# EAGLE design eagle-revg (EAGLE 9.6.2)
COMPANY: ADAFRUIT INDUSTRIES; DRAWN: KTOWN; REV: B
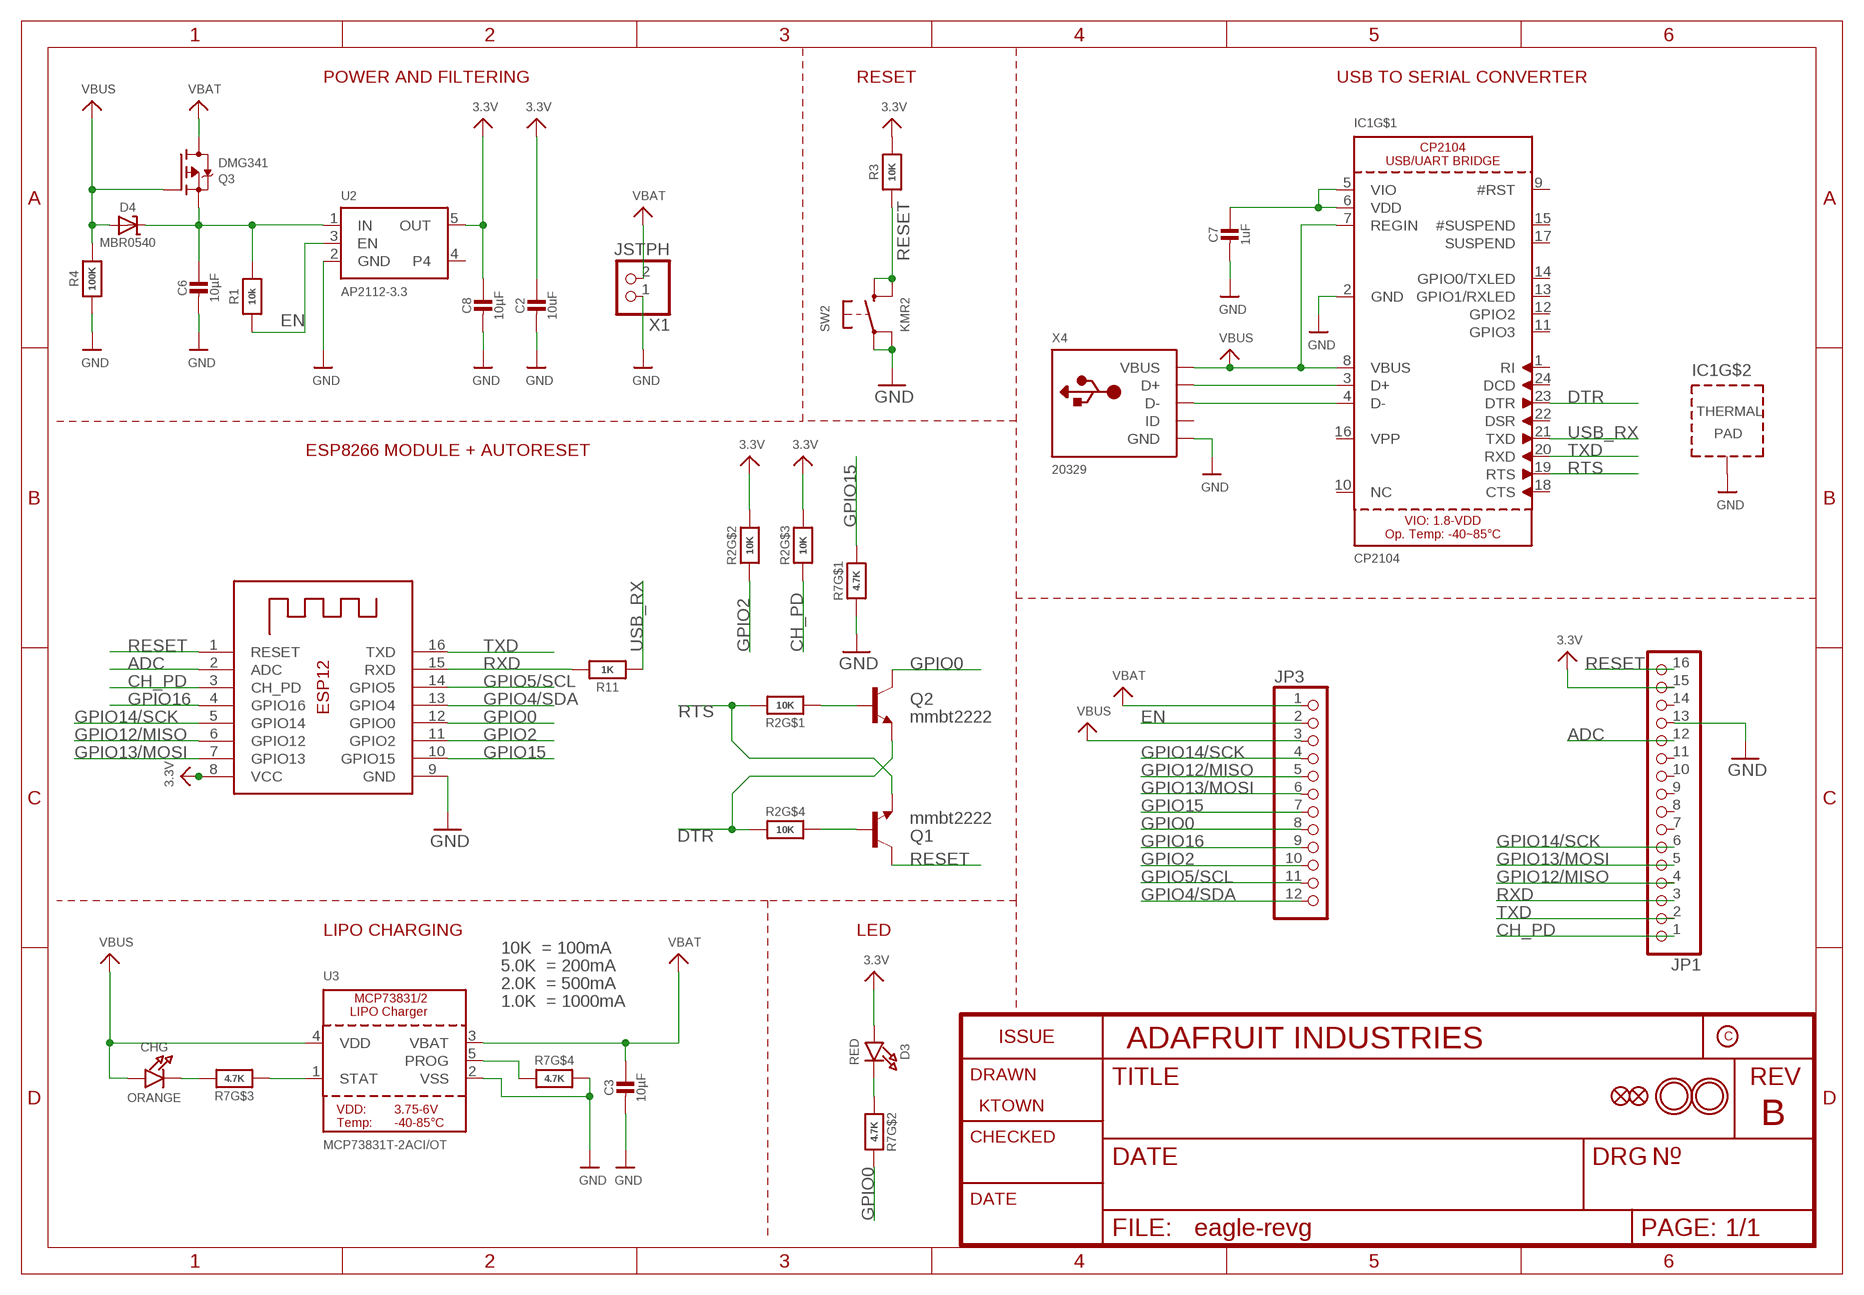
[diagram p0: schematic, sheet 1]

## Parts
C2  10uF  CAP_CERAMIC0805_10MGAP  [0805_10MGAP]
C3  10µF  CAP_CERAMIC0805-NOOUTLINE  [0805-NO]
C6  10µF  CAP_CERAMIC0805-NOOUTLINE  [0805-NO]
C7  1uF  CAP_CERAMIC0603_NO  [0603-NO]
C8  10µF  CAP_CERAMIC0805-NOOUTLINE  [0805-NO]
CHG  ORANGE  LED0603_NOOUTLINE  [CHIPLED_0603_NOOUTLINE]
D3  RED  LED0603_NOOUTLINE  [CHIPLED_0603_NOOUTLINE]
D4  MBR0540  DIODE-SCHOTTKYSOD-123  [SOD-123]
IC1  CP2104  [QFN24_4MM_SMSC]
JP1  HEADER-1X16ROUND  [1X16_ROUND]
JP3  HEADER-1X12  [1X12_ROUND]
Q1  mmbt2222  TRANSISTOR_NPNSOT23-3  [SOT23-3]
Q2  mmbt2222  TRANSISTOR_NPNSOT23-3  [SOT23-3]
Q3  DMG341  MOSFET-P  [SOT23-R]
R1  10k  RESISTOR_0603_NOOUT  [0603-NO]
R2  10K  RESISTOR_4PACK_NO  [RESPACK_4X0603_NO]
R3  10K  RESISTOR_0603_NOOUT  [0603-NO]
R4  100K  RESISTOR_0603_NOOUT  [0603-NO]
R7  4.7K  RESISTOR_4PACK_NO  [RESPACK_4X0603_NO]
R11  1K  RESISTOR_0603_NOOUT  [0603-NO]
SW2  KMR2  SWITCH_TACT_SMT4.6X2.8  [BTN_KMR2_4.6X2.8]
U2  AP2112-3.3  VREG_SOT23-5  [SOT23-5]
U3  MCP73831T-2ACI/OT  MCP73831/2  [SOT23-5]
U$31  MOUNTINGHOLE2.5  [MOUNTINGHOLE_2.5_PLATED]
U$32  MOUNTINGHOLE2.5  [MOUNTINGHOLE_2.5_PLATED]
U$34  FIDUCIAL_1MM  [FIDUCIAL_1MM]
U$35  FIDUCIAL_1MM  [FIDUCIAL_1MM]
X1  JSTPH  CON_JST_PH_2PIN_BATT  [JSTPH2_BATT]
X3  ESP-12F  ESP-12_DOIT_ESP8266  [ESP-12F]
X4  20329  USB_MICRO_20329_V2  [4UCONN_20329_V2]

## Nets
3.3V [power]: C2.1 C8.1 D3.A JP1.15 R2.6 R2.7 R3.2 U2.5(OUT) X3.8(VCC)
ADC: JP1.12 X3.2(ADC)
CH_PD: JP1.1 R2.3 X3.3(CH_PD)
DTR: IC1.23(DTR) Q2.2(E) R2.4
EN: JP3.2 R1.1 U2.3(EN)
GND: C2.2 C3.2 C6.2 C7.2 C8.2 IC1.2(GND) IC1.THERM(TP) JP1.13 R4.1 R7.1 R7.5 SW2.A'(P1) SW2.A(P) U2.2(GND) U3.2(VSS) X1.1 X3.9(GND) X4.BASE@1(GND) X4.BASE@2(GND) X4.GND X4.SPRT@1(GND) X4.SPRT@2(GND) X4.SPRT@3(GND) X4.SPRT@4(GND)
GPIO0: JP3.8 Q2.3(C) R7.7 X3.12(GPIO0)
GPIO2: JP3.10 R2.2 X3.11(GPIO2)
GPIO4/SDA: JP3.12 X3.13(GPIO4)
GPIO5/SCL: JP3.11 X3.14(GPIO5)
GPIO12/MISO: JP1.4 JP3.5 X3.6(GPIO12)
GPIO13/MOSI: JP1.5 JP3.6 X3.7(GPIO13)
GPIO14/SCK: JP1.6 JP3.4 X3.5(GPIO14)
GPIO15: JP3.7 R7.8 X3.10(GPIO15)
GPIO16: JP3.9 X3.4(GPIO16)
N$1: CHG.C R7.6
N$2: IC1.3(D+) X4.D+
N$3: R7.3 U3.1(STAT)
N$4: R7.4 U3.5(PROG)
N$5: D3.C R7.2
N$6: IC1.4(D-) X4.D-
N$8: C7.1 IC1.5(VIO) IC1.6(VDD)
N$12: Q1.1(B) R2.5
N$13: Q2.1(B) R2.1
RESET: JP1.16 Q1.3(C) R3.1 SW2.B'(S1) SW2.B(S) X3.1(RESET)
RTS: IC1.19(RTS) Q1.2(E) R2.8
RXD: JP1.3 R11.2 X3.15(RXD)
TXD: IC1.20(RXD) JP1.2 X3.16(TXD)
USB_RX: IC1.21(TXD) R11.1
VBAT [power]: C3.1 JP3.1 Q3.3(D) U3.3(VBAT) X1.2
VBUS [power]: CHG.A D4.A IC1.7(REGIN) IC1.8(VBUS) JP3.3 Q3.1(G) R4.2 U3.4(VDD) X4.VBUS
VHI [power]: C6.1 D4.C Q3.2(S) R1.2 U2.1(IN)
Unconnected: IC1.1(RI) IC1.9(#RST) IC1.10(NC) IC1.11(GPIO3) IC1.12(GPIO2) IC1.13(GPIO1/RXLED) IC1.14(GPIO0/TXLED) IC1.15(#SUSPEND) IC1.16(VPP) IC1.17(SUSPEND) IC1.18(CTS) IC1.22(DSR) IC1.24(DCD) JP1.7 JP1.8 JP1.9 JP1.10 JP1.11 JP1.14 U2.4 X4.ID

## Notes on the sheet
- POWER AND FILTERING | RESET | USB TO SERIAL CONVERTER
- ESP8266 MODULE + AUTORESET
- LIPO CHARGING | LED
- 10K  = 100mA
- 5.0K  = 200mA
- 2.0K  = 500mA
- 1.0K  = 1000mA

## Library data of the parts
C2 C3 C6 C7 = microbuilder:CAP_CERAMIC: Ceramic Capacitors For new designs, use the packages preceded by an '_' character since they are more reliable: The following footprints should be used on most boards: _0402 - Standard footprint for regular board layouts _0603 - Standard footprint for regular board layouts _0805 - Standard footprint for regular board layouts _1206 - Standard footprint for regular board layouts For extremely tight-pitch boards where space is at a premium, the following 'micro-pitch' footprints can be used (smaller pads, no silkscreen outline, etc.): _0402MP - Micro-pitch footprint for very dense/compact boards _0603MP - Micro-pitch footprint for very dense/compact boards _0805MP - Micro-pitch footprint for very dense/compact boards _1206MP - Micro-pitch footprint for very dense/compact boards
C8 = microbuilder:CAP_CERAMIC: Ceramic Capacitors For new designs, use the packages preceded by an '_' character since they are more reliable: The following footprints should be used on most boards: _0402 - Standard footprint for regular board layouts _0603 - Standard footprint for regular board layouts _0805 - Standard footprint for regular board layouts _1206 - Standard footprint for regular board layouts For extremely tight-pitch boards where space is at a premium, the following 'micro-pitch' footprints can be used (smaller pads, no silkscreen outline, etc.): _0402MP - Micro-pitch footprint for very dense/compact boards _0603MP - Micro-pitch footprint for very dense/compact boards _0805MP - Micro-pitch footprint for very dense/compact boards _1206MP - Micro-pitch footprint for very dense/compact boards; REV: G
CHG D3 = microbuilder:LED: LED 0603 - 0603 Surface Mount Package 2mA: Green LED - Low Power (3.9mcd, 2ma, 1.7Vf) - Digikey: 475-2709-2-ND Orange LED - Low Power (9.8mcd, 2ma, 1.8Vf) - Digikey: 475-1194-2-ND Red LED - Low Power (5mcd, 2ma, 1.8Vf) - Digikey: 475-1195-2-ND Yellow LED - Low Power (7mcd, 2ma, 1.8Vf) - Digikey: 475-1196-2-ND 5mA: Blue LED - Low Power (17mcd, 5ma, 2.9Vf) - Digikey: LNJ937W8CRACT-ND 0805 - 0805 Surface Mount Package 2mA: Red LED (8.8mcd, 2mA, 1.8Vf, Clear) - Low Power [Digikey: 475-2510-1-ND] Green LED (5mcd, 2mA, 1.8Vf, Clear) - Low Power [Digikey: 475-2730-1-ND] Yellow LED (11.3mcd, 2mA, 1.8Vf, Clear) - Low Power [Digikey: 475-2555-1-ND] 20mA: Red LED (104mcd, 20mA, Diffused) - LS R976 [Digikey: 475-1278-6-ND] Red LED (12mcd, 20mA, 2.0Vf, Clear) - APT2012EC [Digikey: 754-1128-1-ND] Green LED (15mcd, 20mA, 2.2Vf, Clear) - APT2012GC [Digikey: 754-1131-1-ND] Orange LED (160mcd, 20mA, 2.1Vf, Clear) - APT2012SECK [Digikey: 754-1130-1-ND] 1206 - 1206 Surface Mount Package Green LED (26mcd, 20mA, Diffused) - LG N971 [Digikey: 475-1407-6-ND] Red LED (15mcd, 20mA, Diffused) - LH N974 [Digikey: 475-1416-6-ND] Cree - Cree High-Power Surface Mount LEDs XPEBWT-L1-0000-00D50 - White 111lm 350mA 2.9Vf 6200K 110° XTEAWT-00-0000-00000LEE3 - White 114lm 350mA 2.85Vf 5000K 115° Everlight - Everlight 45-21 Series Surface Mount LEDs 45-21/QK2C-B2832AC2CB2/2T - Warm White 2000mcd 20mA 3.25Vf 3050K 120° 45-21/LK2C-B38452C4CB2/2T - Nuetral White 2000mcd 20mA 3.25Vf 4150K 120° 45-21/LK2C-B50634C6CB2/2T - Cold White 2200mcd 20mA 3.25Vf 5650K 120° PLCC2 Reverse Mount LS T77K-J1L2-1-0-2-R18-Z - Red 11.25mcd 2mA 1.8Vf 630nm 120° LO T77K-L1M2-24-Z - Orange 19.6mcd 2mA 1.8Vf 606nm 120° LY T77K-K2M1-26-Z - Yellow 15.7mcd 2mA 1.8Vf 587nm 120°
D4 = microbuilder:DIODE-SCHOTTKY
IC1 = microbuilder:CP2104: CP2104 - USB to UART Bridge VDD Output: 3.45V
JP1 = microbuilder:HEADER-1X16: PIN HEADER
JP3 = microbuilder:HEADER-1X12
Q1 Q2 = SparkFun:TRANSISTOR_NPN: Transistor NPN BJT configuration in SOT23 package. MMBT2222 is the common NPN we use. Double check BCE configuration again layout.
Q3 = microbuilder:MOSFET-P: P-Channel Mosfet LEGEND VDS: Voltage Drain-Source ID: Drain Current RDS(ON): Drain-Source On-State Resistance VGS(TH): Gate-Source Threshold Voltage CISS: Drain-Source Input Capacitance SOT-23 Name VDS ID RDS(ON) VGS(TH) CISS Order Number IRLML5103 30V 760mA 600 mOhm -- 75pF @ 25V Digikey: IRLML5103PBFCT-ND IRLML6401 12V 4.3A 50 mOhm 950mV @ 250µA 830pF @ 10V Digikey: IRLML6401PBFTR-ND NTR0202PL 20V 400mA 800 mOhm 2.3V @ 250uA 70pF @ 5V Digikey: NTR0202PLT1GOSTR-ND NTR4101PT1G 20V 1.8A 85 mOhm 1.2V @ 250uA 675pF @ 10V Digikey: NTR4101PT1GOSCT-ND DMP2004K 20V 600mA 900 mOhm 1V @ 250uA 175pF @ 16V Digikey: DMP2004KDICT-ND PMV65XP 20V 3.9A 76 mOhm 950mV @ 1mA 725pF @ 20V Digikey: 568-2358-2-ND TO-252 Name VDS ID RDS(ON) VGS(TH) CISS Order Number AOD417 30V 25A 34 mOhm 3V @ 250µA 920pF @ 15V Digikey: 785-1106-2-ND PowerPak Name VDS ID RDS(ON) VGS(TH) CISS Order Number AON7401 30V 12A 14 mOhm 3V @ 250µA 2600pF @ 15V Digikey: 785-1302-1-ND
R1 R3 R4 R11 = microbuilder:RESISTOR: Resistors For new designs, use the packages preceded by an '_' character since they are more reliable: The following footprints should be used on most boards: _0402 - Standard footprint for regular board layouts _0603 - Standard footprint for regular board layouts _0805 - Standard footprint for regular board layouts _1206 - Standard footprint for regular board layouts For extremely tight-pitch boards where space is at a premium, the following 'micro-pitch' footprints can be used (smaller pads, no silkscreen outline, etc.): _0402MP - Micro-pitch footprint for very dense/compact boards _0603MP - Micro-pitch footprint for very dense/compact boards _0805MP - Micro-pitch footprint for very dense/compact boards _1206MP - Micro-pitch footprint for very dense/compact boards
R2 R7 = microbuilder:RESISTOR_4PACK: Resistor Packs (4 resistors) 4 x 0603 10K 1/16W - Digikey: YC164J-10KCT-ND
SW2 = microbuilder:SWITCH_TACT_SMT: SMT Tact Switches 6x6mm - Digikey: P12940SCT-ND KMR2 (4.6x2.8mm) - Digikey: 401-1426-1-ND EVQ-PQHB55 - Light Touch, 160GF (4.5x4.5mm) - Digikey: P8090SCT-ND KMT0 - KMT021 NGJ LHS (etc.) IP68/Waterproof - Digikey: CKN10289CT-ND
U2 = microbuilder:VREG_SOT23-5: SOT23-5 Fixed Voltage Regulators Part Current Out V Out V In V Dropout θJA (°C/W) TJ (°C) Digikey Part No. ADP121 150mA 3.3V 3.4-5.5V 0.09V @ 150mA -- -- ADP121-AUJZ33R7CT-ND ADP121 150mA 3.0V 3.1-5.5V 0.09V @ 150mA -- -- ADP121-AUJZ30R7CT-ND ADP122 300mA 3.3V 3.4-5.5V 0.085V @ 300mA -- -- ADP122AUJZ-3.3-R7CT-ND ADP1712 300mA 3.3V 3.5-5.5V 0.17V @ 300mA -- -- ADP1712AUJZ-3.3-R7TR-ND AP7311 (Low Cost) 150mA 3.3V 3.5-6V 0.15V @ 150mA -- -- AP7311-33WG-7DICT-ND LD39015M18R 150mA 1.8V 1.9V-5.5V 0.08V @ 100mA -- -- 497-6977-1-ND LP2985A-33DBVR 150mA 3.3V 3.3-16V 0.28V @ 150mA 206 150 296-18479-1-ND MCP1824T-3302E/OT 300mA 3.3V 3.5V-6V 0.2V @ 300mA -- -- MCP1824T-3302E/OTCT-ND MIC5205-2.5YM5 TR 150mA 2.5V 2.7-16V 0.165V @ 150mA -- -- 576-1257-2-ND MIC5205-3.0YM5 TR 150mA 3.0V 3.2V-16V 0.165V @ 150mA -- -- 576-1258-2-ND MIC5205-3.3YM5 TR 150mA 3.3V 3.5V-16V 0.165V @ 150mA -- -- 576-1259-2-ND TPS780330220 150mA 3.3V+2.2V 3.6-5.5V 250mV Max -- -- 296-23332-1-ND TDA3663/N1,135 100mA 3.3V 3.5-45V 0.18V @ 50mA -- -- 568-5343-1-ND Max operating temp can be calculated using θJA, TJ (max junction temperature), and power in watts. Set the "Maximum Ambient Temperature" until it reaches TJ ("Max Junction Temperature"), which is the absolute limit for safe use of the regulator: Heat Sink Temperature Calculator <http://www.daycounter.com/Calculators/Heat-Sink-Temperature-Calculator.phtml> For example, With 12V source into a 3.3V LP2985 and a 30mA load, we are dissipating (12V-3.3V) * 0.03A = 0.261W. With a θJA of 206 °C/W, a TJ of 150°C, and 261mW we can safely use the chip without a heat sink up to 75°C (=147.1°C Junction Temperature).
U3 = microbuilder:MCP73831/2: MCP73831/2 LIPO Charger VDD: 3.75 - 6V Temp -40 - 85°C Programmable Charge Rate: 15-500mA NOTE: STAT is a tri-state logic output on the MCP73831 and an open-drain output on the MCP73832. SOT23-5 with 4.2V output and tri-state logic on STAT = MCP73831T-2ACI/OT
U$31 U$32 = microbuilder:MOUNTINGHOLE: Mounting Hole For #2 screws (0.086"/2.18mm width, 0.094"/2.4mm hole) use 2.5mm; BOM: EXCLUDE
U$34 U$35 = microbuilder:FIDUCIAL: Fiducial Alignment Points Various fiducial points for machine vision alignment.; BOM: EXCLUDE
X1 = microbuilder:CON_JST_PH_2PIN: JST 2-Pin Right-Angle Connector PH-Series - 4UConnector: 17311 SH-Series - 4UConnector: 07278
X3 = microbuilder:ESP-12
X4 = microbuilder:USB: USB Connectors USBMINIB - Surface Mount Female Mini-B USB Connector 4UConnector: 06564

## Net classes
1 power: width 0.305 mm
2 gnd: width 0.254 mm

## Board
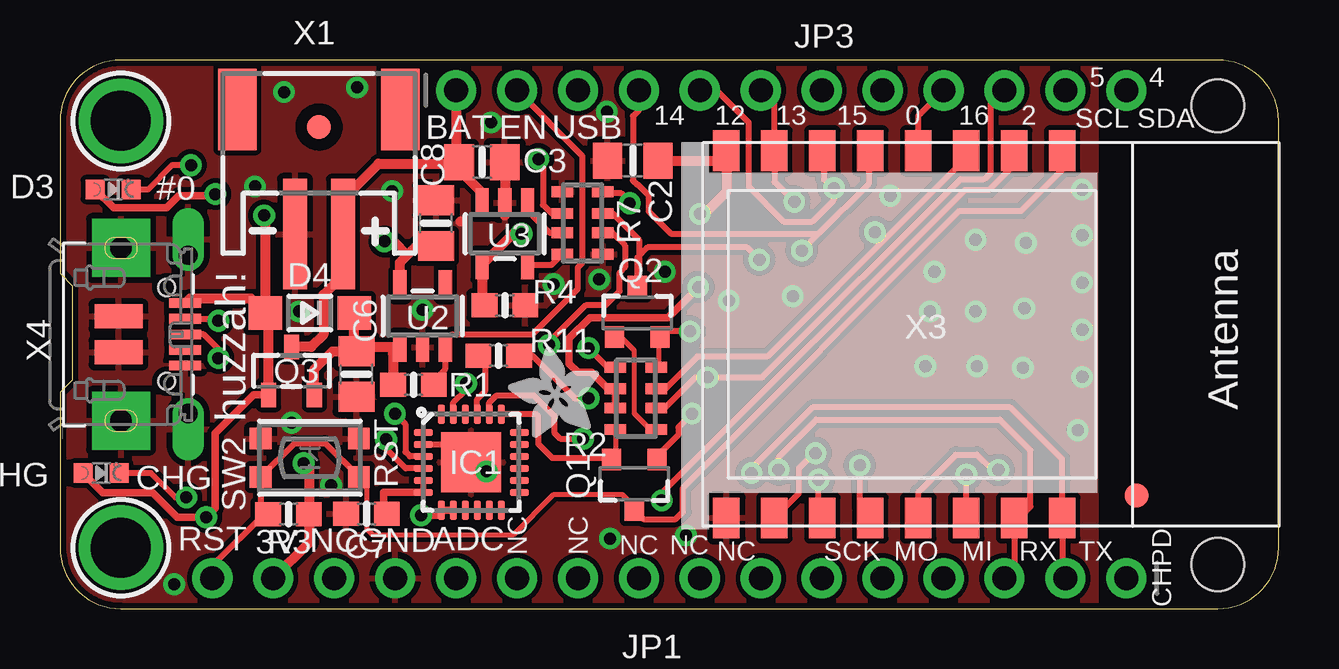
[diagram p1: board, top side]
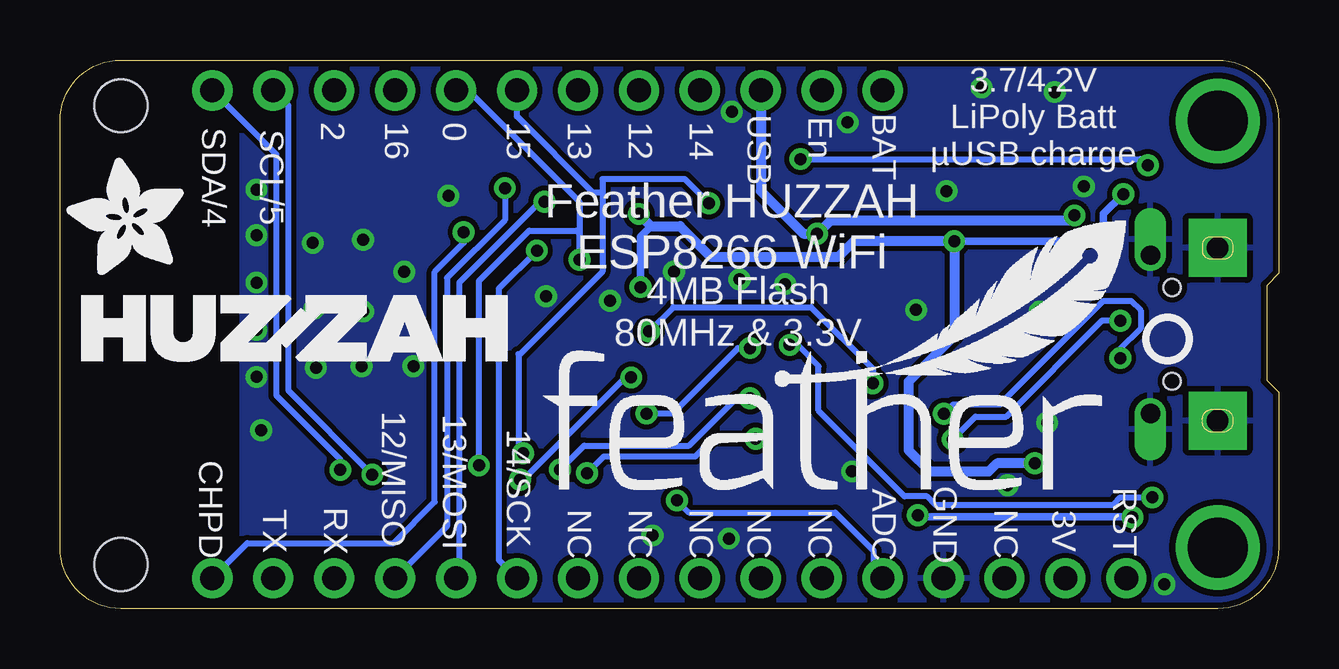
[diagram p2: board, bottom side, seen from below]

Size 50.8 x 22.86 mm. Coordinates in mm from the lower left corner, seen from the top.
Outline: 2.54,0 48.26,0 arc90 50.8,2.54 50.8,20.32 arc90 48.26,22.86 2.54,22.86 arc90 0,20.32 0,13.97 0.51,13.46 0.51,9.53 0,9.02 0,2.54 arc90 2.54,0
Copper layers (1*16): Top 0.035mm / dielectric 1.5mm / Bottom 0.035mm
Design rules "adafruit *": minimum track width 8mil, minimum drill 15.5mil, track to track 8mil, track to pad 8mil, pad to pad 8mil, via to via 8mil, smd to smd 8mil, copper to edge 10mil, drill to drill 8mil, minimum pad ring 10mil, minimum via ring 8mil, stop-mask expansion 2mil, vias tented up to drill 20mil, thermal gap 10mil
Holes 2.2 mm at 48.26,1.84 48.26,20.95

### Footprints (pad centres in the part's own frame; a part is rotated, then mirrored left to right if it is on the bottom)
0805_10MGAP = smd 1.2 x 1.5: 1 -1.05,0; 2 1.05,0
0805-NO = smd 1.24 x 1.5: 1 -0.95,0; 2 0.95,0
0603-NO = smd 1.075 x 1: 1 -0.85,0; 2 0.85,0
CHIPLED_0603_NOOUTLINE = smd 0.8 x 0.8: A 0,-0.75; C 0,0.75
SOD-123 = smd 1.4 x 1.4: A 1.85,0; C -1.85,0
QFN24_4MM_SMSC = smd 0.8 x 0.28: 1 -2,1.25; 2 -2,0.75; 3 -2,0.25; 4 -2,-0.25; 5 -2,-0.75; 6 -2,-1.25; 13 2,-1.25; 14 2,-0.75; 15 2,-0.25; 16 2,0.25; 17 2,0.75; 18 2,1.25 | smd 0.28 x 0.8: 7 -1.25,-2; 8 -0.75,-2; 9 -0.25,-2; 10 0.25,-2; 11 0.75,-2; 12 1.25,-2; 19 1.25,2; 20 0.75,2; 21 0.25,2; 22 -0.25,2; 23 -0.75,2; 24 -1.25,2 | smd 2.5 x 2.5: THERM 0,0
1X16_ROUND = drill 1 pad 1.676: 1 -19.05,0; 2 -16.51,0; 3 -13.97,0; 4 -11.43,0; 5 -8.89,0; 6 -6.35,0; 7 -3.81,0; 8 -1.27,0; 9 1.27,0; 10 3.81,0; 11 6.35,0; 12 8.89,0; 13 11.43,0; 14 13.97,0; 15 16.51,0; 16 19.05,0
1X12_ROUND = drill 1 pad 1.676: 1 -13.97,0; 2 -11.43,0; 3 -8.89,0; 4 -6.35,0; 5 -3.81,0; 6 -1.27,0; 7 1.27,0; 8 3.81,0; 9 6.35,0; 10 8.89,0; 11 11.43,0; 12 13.97,0
SOT23-3 = smd 0.8 x 0.9: 1 -0.95,-1; 2 0.95,-1; 3 0,1.1
SOT23-R = smd 0.635 x 1.016: 1 -0.95,-1; 2 0.95,-1; 3 0,1
RESPACK_4X0603_NO = smd 0.45 x 0.9: 1 -1.3,-0.85; 2 -0.4,-0.85; 3 0.4,-0.85; 4 1.3,-0.85; 5 1.3,0.85; 6 0.4,0.85; 7 -0.4,0.85; 8 -1.3,0.85
BTN_KMR2_4.6X2.8 = smd 0.9 x 0.9: A 2.05,0.8; A' -2.05,0.8; B 2.05,-0.8; B' -2.05,-0.8
SOT23-5 = smd 0.55 x 1.2: 1 -0.95,-1.3; 2 0,-1.3; 3 0.95,-1.3; 4 0.95,1.3; 5 -0.95,1.3
MOUNTINGHOLE_2.5_PLATED = drill 2.5 pad 3.2: P$1 0,0
FIDUCIAL_1MM = smd 1 x 1: 1 0,0
JSTPH2_BATT = smd 1 x 4.6: 1 -1,-3.7; 2 1,-3.7 | smd 1.6 x 3.4: NC1 -3.4,1.5; NC2 3.4,1.5
ESP-12F = smd 1.7 x 1.1: 1 -7.65,5.77; 2 -7.65,3.77; 3 -7.65,1.77; 4 -7.65,-0.23; 5 -7.65,-2.23; 6 -7.65,-4.23; 7 -7.65,-6.23; 8 -7.65,-8.23; 9 7.65,-8.23; 10 7.65,-6.23; 11 7.65,-4.23; 12 7.65,-2.23; 13 7.65,-0.23; 14 7.65,1.77; 15 7.65,3.77; 16 7.65,5.77
4UCONN_20329_V2 = smd 1 x 2: BASE@1 -0.75,-2; BASE@2 0.75,-2 | smd 0.4 x 1.35: D+ 0,0.775; D- -0.65,0.775; GND 1.3,0.775; ID 0.65,0.775; VBUS -1.3,0.775 | drill 0.8 pad 1.143 offset: SPRT@1 -3.3,0.9; SPRT@2 3.3,0.9 | drill 0.9 pad 2.413 square: SPRT@3 -3.6,-1.9; SPRT@4 3.6,-1.9 | hole 0.7: -1.95,0; 1.95,0

### Placement (x,y rotation side)
C2  23.88,18.67 180 top
C3  17.59,18.61 0 top
C6  12.36,9.77 270 top
C7  12.78,3.95 180 top
C8  15.67,16.06 90 top
CHG  1.71,5.65 270 top
D3  2.22,17.46 270 top
D4  10.41,12.32 180 top
IC1  17.14,6.1 0 top
JP1  25.4,1.27 180 top
JP3  30.48,21.59 0 top
Q1  23.94,5.21 180 top
Q2  24.07,12.32 0 top
Q3  9.65,9.91 0 top
R1  14.73,9.33 180 top
R2  24,8.76 90 top
R3  9.53,3.94 0 top
R4  18.54,12.64 180 top
R7  21.78,16.07 270 top
R11  18.29,10.54 0 top
SW2  10.41,6.29 0 top
U2  15.11,12.19 0 top
U3  18.54,15.62 180 top
U$7  [ADAFRUIT_5MM]  45.66,13.91 90 bottom
U$9  [FEATHERLOGO]  30.67,4.89 0 bottom
U$13  [PCBFEAT-REV-040]  4.64,11.24 0 bottom
U$15  [ADAFRUIT_3.5MM]  22.48,7.11 90 top
U$23  [HUZZAHLOGO]  49.91,10.29 0 bottom
U$31  2.54,20.32 270 top
U$32  2.54,2.54 270 top
U$34  10.79,20.07 270 top
U$35  44.88,4.71 270 top
X1  10.79,19.3 0 top
X3  36,11.43 270 top
X4  4.45,11.43 270 top

### Tracks (layer width: path | path; a pad name or v marks a point on that pad's centre or on a via)
3.3V  (via drill 0.5)
  Top 0.305: R2.7 R2.6 22.84,9.16 22.16,9.84 21.59,9.84 21.23,10.21 21.23,11.26 22.1,12.13 25.34,12.13 v26.61,13.4 | D3.A 2.23,16.7 4.45,16.7 4.95,17.21 6.41,17.21 v6.48,17.27
  Top 0.406: C8.1 14.86,15.11 14.48,14.73 | 14.48,14.73 14.16,14.41 U2.5 | JP1.15 10.38,2.75 R3.2 10.38,5.84 v10.16,6.05 | C2.1 27.36,18.67 X3.8 27.77,17.36 26.86,16.45 v26.67,16.45 | v13.53,15.3 13.91,15.3 14.48,14.73
  Bottom 0.305: v6.48,17.27 7.3,16.45 7.3,16 8,15.3 v13.53,15.3 | v26.61,13.4 26.61,15.49 26.16,15.94
  Bottom 0.406: v26.67,16.45 26.16,15.94 24.96,15.94 23.69,14.67 18.35,14.67 17.72,15.3 v13.53,15.3 13.53,11.37 15.43,9.46 15.43,6.6 14.54,5.71 12.09,5.71 11.75,6.05 v10.16,6.05
ADC  (via drill 0.5)
  Top 0.254: v25.08,4.51 25.08,4.8 37.72,17.44 38.73,17.44 39.77,18.49 X3.2
  Bottom 0.254: v25.08,4.51 24.57,4 18.48,4 16.89,2.41 16.89,1.97 16.57,1.65 16.57,1.33 JP1.12
CH_PD  (via drill 0.5)
  Top 0.254: R2.3 25.23,9.16 26.57,10.5 29.48,10.5 34.32,15.34 | X3.3 37.77,18.79 34.32,15.34 | v33.97,15.68 34.32,15.34
  Bottom 0.254: JP1.1 42.99,2.73 36.89,2.73 35.18,4.45 35.18,14.03 33.97,15.24 v33.97,15.68
DTR  (via drill 0.5)
  Top 0.203: 25.08,11.3 25.03,11.3 Q2.2 | 24.95,11.56 24.95,11.43 24.95,10.16 R2.4
  Top 0.254: v16.92,9.38 16.92,9.11 16.39,8.58 IC1.23 | v26.25,11.55 24.96,11.55 24.95,11.56 | 24.95,11.43 25.08,11.3
  Bottom 0.254: v16.92,9.38 16.92,10 19.49,12.57 25.23,12.57 v26.25,11.55
EN
  Top 0.254: R1.1 15.58,9.52 16.06,10 U2.3 16.06,11.15 16.35,11.43 19.69,11.43 21.59,13.33 21.59,14.22 21.78,14.41 21.78,18.86 JP3.2
GND  (via drill 0.5)
  Top 0.203: 17.4,6.1 v17.78,5.71 | IC1.THERM 17.4,6.1 | 17.4,6.1 18.03,6.73
  Top 0.254: IC1.2 17.03,6.85 17.14,6.73 IC1.THERM | 18.03,6.73 17.92,6.85
  Top 0.406: C3.2 U3.2 18.54,16.38 | 16.71,16.14 16.69,16.14 | 15.82,17.01 C8.2
  other vias: 17.97,20.26 27.88,12.83 30.54,13.02 36.26,12.38 38.16,12.38 38.23,10.1 36.07,10.1 42.42,7.43 40.26,15.24 38.16,15.37 36.45,14.03 40.13,10.03 40.2,12.51 42.61,9.65 42.61,11.62 42.61,13.59 42.61,15.56 42.61,17.46 26.1,3.05 22.92,2.92 34.61,17.21 13.84,17.4 15.11,12.45 20.57,13.53 9.33,21.53 12.38,21.72 8.13,17.59 22.8,20.7 22.48,13.72 9.65,7.75 4.76,1.02 25.21,14.03 11.3,5.14 9.97,12.38
  pour Top: 0,22.86 0,0 43.18,0 43.18,22.86
  pour Bottom: -0.13,0.25 43.18,0 43.18,22.86 0,22.86
GPIO0  (via drill 0.5)
  Top 0.254: R7.7 23.03,16.46 24.13,15.37 24.13,13.48 Q2.3 24.07,14.63 24.49,15.05 28.64,15.05 v29.15,14.54 | X3.12 33.34,4.22 v33.34,5.97
  Bottom 0.254: v33.34,5.97 33.34,13.65 31.24,15.75 29.27,15.75 29.15,15.62 v29.15,14.54 29.15,16.95 33.78,21.59 JP3.8
GPIO2  (via drill 0.5)
  Top 0.254: R2.2 25.21,8.36 26.48,9.63 v26.99,9.63 29.27,9.63 37.53,17.9 38.54,17.9 38.8,18.16 38.8,21.02 JP3.10 | X3.11 31.62,3.93 v31.62,5.37
  Bottom 0.254: v31.62,5.37 31.49,5.37 26.99,9.87 v26.99,9.63
GPIO4/SDA  (via drill 0.5)
  Top 0.254: X3.13 35.77,4.85 37.34,6.41 38.23,6.41 38.86,5.78 v39.12,5.78
  Bottom 0.254: v39.12,5.78 39.12,6.22 41.78,8.89 41.78,18.92 JP3.12
GPIO5/SCL  (via drill 0.5)
  Top 0.254: X3.14 v37.77,5.58 v37.78,5.59
  Bottom 0.254: v37.78,5.59 41.27,9.08 41.27,20.95 JP3.11
GPIO12/MISO  (via drill 0.5)
  Top 0.254: X3.6 31.84,19.02 31.84,17.88 32.19,17.53 v32.26,17.53 32.26,17.02 31.37,16.13 30.16,16.13 28.7,17.59 28.7,20.26 27.37,21.59 JP3.5
  Bottom 0.254: JP1.4 34.67,3.43 34.67,13.78 32.26,16.19 v32.26,17.53
GPIO13/MOSI  (via drill 0.5)
  Top 0.254: JP3.6 29.77,21.03 X3.7 29.77,17.79 v30.61,16.95
  Bottom 0.254: v30.61,16.95 30.8,16.95 34.16,13.59 34.16,1.4 JP1.5
GPIO14/SCK  (via drill 0.5)
  Top 0.254: X3.5 33.71,19.02 33.71,17.71 31.62,15.62 | 31.62,15.62 v30.92,14.92 | JP3.4 24.13,20.77 23.88,20.52 23.88,17.84 24.05,17.67 24.07,17.67 24.53,17.21 24.53,16.55 25.46,15.62 31.62,15.62
  Bottom 0.254: v30.92,14.92 32.51,13.34 32.51,2.03 JP1.6
GPIO15  (via drill 0.5)
  Top 0.254: R7.8 22.69,17.3 23.4,17.3 23.75,16.95 v23.75,16.89 | X3.10 30.79,4.8 30.79,5.83 31.43,6.48 v31.5,6.48
  Bottom 0.254: v23.75,16.89 24.77,17.91 28.19,17.91 28.19,17.34 | 28.19,17.34 28.57,17.34 31.75,20.51 JP3.7 | v31.5,6.48 31.69,6.48 31.69,10.6 31.62,10.6 28.19,14.03 28.19,17.34
GPIO16
  Top 0.254: X3.4 35.77,20.54 JP3.9
N$1  (via drill 0.5)
  Top 0.254: v5.27,4.64 4.81,4.64 3.8,5.65 CHG.C | v20.38,10.99 20.38,11.11 21.91,12.64 22.73,12.64 23.33,13.23 23.3,13.26 23.3,13.97 23.34,14 23.34,14.01 23.55,14.21 23.55,15.13 23.01,15.66 R7.6
  Bottom 0.254: v20.38,10.99 20.07,10.99 19.18,10.1 19.18,8.26 15.6,4.68 14.66,4.68 14.3,4.32 6.92,4.32 6.6,4.64 v5.27,4.64
N$2  (via drill 0.5)
  Top 0.254: IC1.3 14.59,6.35 14.4,6.53 14.4,7.67 v13.96,8.12 | v6.6,10.44 6.6,10.82 6,11.43 X4.D+
  Bottom 0.254: v6.6,10.44 6.6,10.82 5.76,11.67 5.76,12.43 6.16,12.83 7.3,12.83 11.62,8.51 13.57,8.51 v13.96,8.12
N$3
  Top 0.254: U3.1 19.49,16.58 20.4,15.66 R7.3
N$4
  Top 0.254: U3.5 20.49,14.32 R7.4
N$5  (via drill 0.5)
  Top 0.254: R7.2 20.49,16.46 20.13,16.83 20.13,18.54 v19.94,18.73 | v5.46,18.48 4.69,18.48 3.67,17.46 D3.C
  Bottom 0.254: v19.94,18.73 5.78,18.73 5.52,18.48 v5.46,18.48
N$6  (via drill 0.5)
  Top 0.254: X4.D- 6.52,12.08 v6.6,12 | IC1.4 14.41,5.85 13.59,6.67 v13.59,7.05
  Bottom 0.254: v6.6,12 7.37,12 11.36,8 12.64,8 v13.59,7.05
N$8
  Top 0.254: IC1.5 IC1.6
  Top 0.305: IC1.6 13.5,4.85 13.5,4.08 C7.1
N$12  (via drill 0.5)
  Top 0.254: R2.5 22.83,10.06 v22.04,10.86 | v26.35,8.13 25.78,7.56 25.78,7.24 24.89,6.35 Q1.1
  Bottom 0.254: v22.04,10.86 22.54,10.86 25.27,8.13 v26.35,8.13
N$13
  Top 0.203: R2.1 24.61,7.46 23.94,8.13 23.94,10.75 23.37,11.32 Q2.1
RESET
  Top 0.203: SW2.B 12.46,5.33 12.78,5.01 12.78,3.33 13.03,3.09 18.9,3.09 20.57,4.76 23.43,4.76 23.91,4.29
  Top 0.254: R3.1 8.59,4.02 | 8.59,4.02 8.38,4.23 8.38,5.49 SW2.B' 9.78,6.9 11.05,6.9 SW2.B | JP1.16 6.35,1.78 8.59,4.02 | X3.1 41.77,18.28 40.07,16.57 37.5,16.57 25.97,5.04 25.97,4.04 25.66,3.73 24.32,3.73 Q1.3 23.91,4.14 23.91,4.29
RTS
  Top 0.203: R2.8 23.15,6.37 Q1.2
  Top 0.254: Q1.2 22.93,6.27 20.53,6.27 19.94,6.86 19.94,8.01 19.85,8.1 IC1.19
RXD  (via drill 0.5)
  Top 0.254: JP1.3 39.77,1.68 X3.15 39.98,3.78 40.45,4.25 40.45,6.6 39.18,7.87 31.52,7.87 29.95,6.3 v29.95,5.8 | R11.2 19.69,10.54 21.47,8.76 v22.04,8.76
  Bottom 0.254: v22.04,8.76 22.61,8.76 24.58,6.79 28.96,6.79 v29.95,5.8
TXD  (via drill 0.5)
  Top 0.254: JP1.2 41.77,1.41 X3.16 41.77,6.23 39.62,8.38 31.37,8.38 28.83,5.84 v28.83,5.65 | v21.8,7.08 20.85,7.08 20.59,7.34 20.59,8.04 19.75,8.89 18.2,8.89 17.89,8.58 IC1.20
  Bottom 0.254: v21.8,7.08 23.58,7.08 24.33,6.34 28.14,6.34 v28.83,5.65
USB_RX
  Top 0.254: R11.1 17.71,10.27 17.71,9.05 17.39,8.73 IC1.21
VBAT
  Top 0.406: Q3.3 10.48,10.91 10.99,11.41 10.99,13.08 11.79,13.89 X1.2 11.79,17.06 13.27,18.54 16.64,18.54 | 16.64,18.54 C3.1 16.51,18.73 JP3.1 | 16.64,18.54 16.64,18.29 17.59,17.33 U3.3
VBUS  (via drill 0.5)
  Top 0.305: IC1.7 IC1.8 15.95,4.1 15.75,3.9 v15.05,3.9 | Q3.1 8.08,8.91 6.48,7.3 6.48,4.19 v6.1,3.81 4.89,3.81 3.87,4.83 1.79,4.83 CHG.A
  Top 0.406: X4.VBUS 5.41,12.92 7.96,12.92 D4.A | R4.2 17.59,12.74 U3.4 18.89,15.62 v19.24,15.62 | Q3.1 8.7,12.18 D4.A | D4.A 8.56,16.33 v8.51,16.38
  Bottom 0.305: v6.1,3.81 6.12,3.83 15.05,3.83 v15.05,3.9
  Bottom 0.406: JP3.3 21.59,17.4 19.81,15.62 v19.24,15.62 18.67,16.19 8.7,16.19 v8.51,16.38
VHI
  Top 0.406: 12.26,11.05 12.26,10.82 C6.1 11.36,10.72 10.6,9.97 Q3.2 | 12.26,11.05 D4.C | 12.26,11.05 12.42,10.89 U2.1 13.88,10.61 R1.2

### Text on the board
tPlace: 5 | 4 | 14 | 12 | 13 | 15 | 0 | 16 | 2 | BAT | EN | USB | SCL | SDA | #0 | huzzah! | RST | CHG | RST | 3V | NC | GND | ADC | NC | NC | NC | NC | NC | SCK | MO | MI | RX | TX | CHPD
bPlace: 3.7/4.2V / LiPoly Batt / µUSB charge | En | 0 | 2 | BAT | USB | 14 | 12 | 13 | 15 | 16 | SCL/5 | SDA/4 | Feather HUZZAH / ESP8266 WiFi | 4MB Flash / 80MHz & 3.3V | 14/SCK | 13/MOSI | 12/MISO | RST | CHPD | 3V | NC | GND | ADC | NC | NC | NC | NC | NC | RX | TX